# Altium schematic sheet 09 USB.SchDoc
size 420 x 297 mm
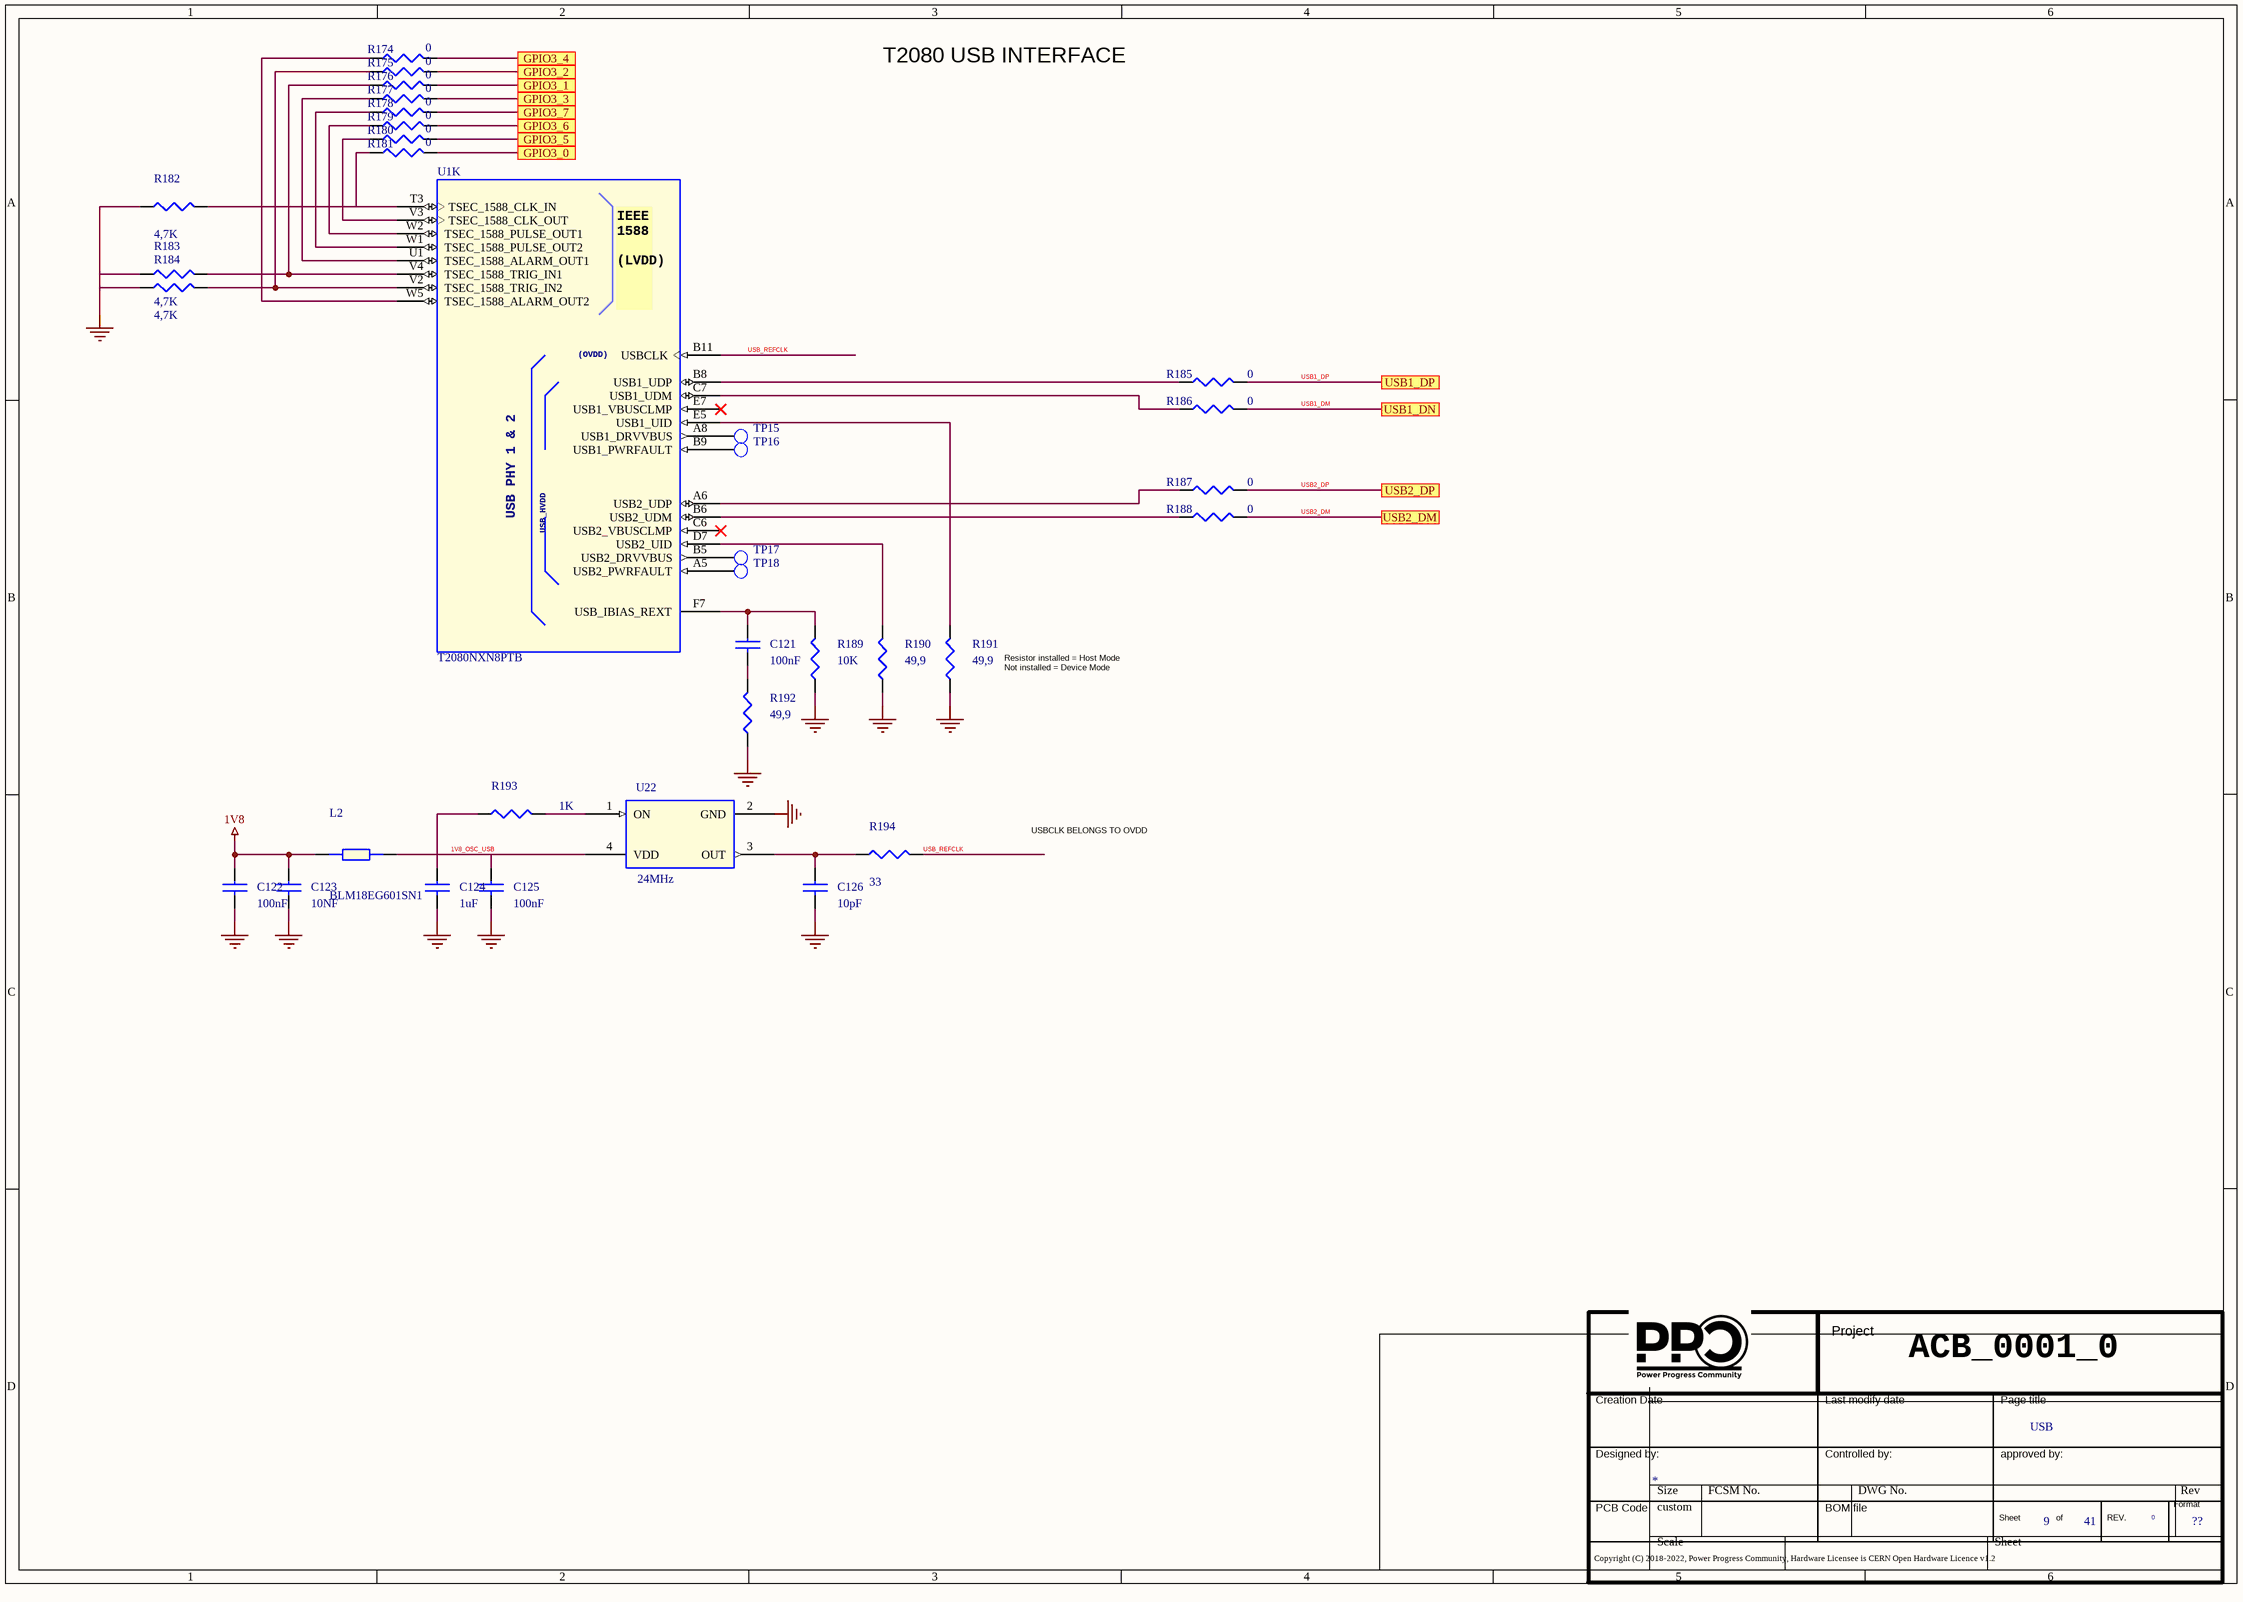
[diagram p0: 09 USB.SchDoc]

## Parts
*  Doc: USB  Page Count: 41  Page Number: 9  Page Size: ??  RevCode: 0  (hidden comment: Title_block_PPC)  (graphical)
C121  100nF  [SMD_0402]
C122  100nF  [SMD_0402]
C123  10NF  [SMD_0402]
C124  1uF  [SMD_0402]
C125  100nF  [SMD_0402]
C126  10pF  [SMD_0402]
L2  BLM18EG601SN1  [SMD_0603]
R174  0  [SMD_0402]
R175  0  [SMD_0402]
R176  0  [SMD_0402]
R177  0  [SMD_0402]
R178  0  [SMD_0402]
R179  0  [SMD_0402]
R180  0  [SMD_0402]
R181  0  [SMD_0402]
R182  4,7K  [SMD_0402]
R183  4,7K  [SMD_0402]
R184  4,7K  [SMD_0402]
R185  0  [SMD_0402]
R186  0  [SMD_0402]
R187  0  [SMD_0402]
R188  0  [SMD_0402]
R189  10K  [SMD_0402]
R190  49,9  [SMD_0402]
R191  49,9  [SMD_0402]
R192  49,9  [SMD_0402]
R193  1K  [SMD_0402]
R194  33  [SMD_0402]
TP15  TEST POINT  [PCB]  (value not drawn)
TP16  TEST POINT  [PCB]  (value not drawn)
TP17  TEST POINT  [PCB]  (value not drawn)
TP18  TEST POINT  [PCB]  (value not drawn)
U1  T2080NXN8PTB  [bga]  (part K of 14)
U22  24MHz  [4 PIN SMT]

## Ports
GPIO3_0, GPIO3_1, GPIO3_2, GPIO3_3, GPIO3_4, GPIO3_5, GPIO3_6, GPIO3_7, USB1_DN, USB1_DP, USB2_DM, USB2_DP

## Nets
1V8: C122.1 C123.1 L2.1
GND: C122.2 C123.2 C124.2 C125.2 C126.2 R182.1 R183.1 R184.1 R189.1 R190.1 R191.1 R192.1 U22.2(GND)
1V8_OSC_USB: C124.1 C125.1 L2.2 R193.1 U22.4(VDD)
GPIO3_0: R181.2 ; port GPIO3_0
GPIO3_1: R176.2 ; port GPIO3_1
GPIO3_2: R175.2 ; port GPIO3_2
GPIO3_3: R177.2 ; port GPIO3_3
GPIO3_4: R174.2 ; port GPIO3_4
GPIO3_5: R180.2 ; port GPIO3_5
GPIO3_6: R179.2 ; port GPIO3_6
GPIO3_7: R178.2 ; port GPIO3_7
USB1_DM: R186.2 ; port USB1_DN
USB1_DP: R185.2 ; port USB1_DP
USB2_DM: R188.2 ; port USB2_DM
USB2_DP: R187.2 ; port USB2_DP
USB_REFCLK: R194.2 U1.B11(USBCLK)
NetC121_1: C121.1 R189.2 U1.F7(USB_IBIAS_REXT)
NetC121_2: C121.2 R192.2
NetC126_1: C126.1 R194.1 U22.3(OUT)
NetR174_1: R174.1 U1.W5(TSEC_1588_ALARM_OUT2)
NetR175_1: R175.1 R184.2 U1.V2(TSEC_1588_TRIG_IN2)
NetR176_1: R176.1 R183.2 U1.V4(TSEC_1588_TRIG_IN1)
NetR177_1: R177.1 U1.U1(TSEC_1588_ALARM_OUT1)
NetR178_1: R178.1 U1.W1(TSEC_1588_PULSE_OUT2)
NetR179_1: R179.1 U1.W2(TSEC_1588_PULSE_OUT1)
NetR180_1: R180.1 U1.V3(TSEC_1588_CLK_OUT)
NetR181_1: R181.1 R182.2 U1.T3(TSEC_1588_CLK_IN)
NetR185_1: R185.1 U1.B8(USB1_UDP)
NetR186_1: R186.1 U1.C7(USB1_UDM)
NetR187_1: R187.1 U1.A6(USB2_UDP)
NetR188_1: R188.1 U1.B6(USB2_UDM)
NetR190_2: R190.2 U1.D7(USB2_UID)
NetR191_2: R191.2 U1.E5(USB1_UID)
NetR193_2: R193.2 U22.1(ON)
NetTP15_1: TP15.1(TP) U1.A8(USB1_DRVVBUS)
NetTP16_1: TP16.1(TP) U1.B9(USB1_PWRFAULT)
NetTP17_1: TP17.1(TP) U1.B5(USB2_DRVVBUS)
NetTP18_1: TP18.1(TP) U1.A5(USB2_PWRFAULT)

Not connected (* = marked no-connect by the designer): U1 C6(USB2_VBUSCLMP)* E7(USB1_VBUSCLMP)*

## Notes on the sheet
- T2080 USB INTERFACE
- Resistor installed = Host Mode
  Not installed = Device Mode
- USBCLK BELONGS TO OVDD
- ACB_0001_0
- (in symbol T2080, part K) IEEE 1588 / (LVDD); (OVDD); USB PHY 1 & 2; USB_HVDD
- (in symbol Title_block_PPC) Project; Creation Date; Last modify date; Page title; Designed by:; Controlled by:; approved by:; Format; PCB Code; BOM file; Sheet; of; REV.; Copyright (C) 2018-2022, Power Progress Community, Hardware Licensee is CERN Open Hardware Licence v1.2

## Library data of the parts
* = Title_block_PPC: Title: T2080PCIe; Author: MICETEK; Page Create Date: March  8, 1995; Page Title: ?; Page Modify Date: *
C121 = CAP NP_Dup3: COND.CER. 100NF 50V 0402 X7R SMD; Part Number: PASSIVE_24; Manufacturer 1: TDK; Manufacturer Part Number 1: CGA2B3X7R1H104M050BD; RSM: RC0402; Part Type: Capacitors\Ceramic\SMD\0402; PCB Footprint: SMD_0402
C122 C125 = CAP NP_Dup3: COND.CER. 100NF 50V 0402 X7R SMD; Manufacturer Part Number 1: CGA2B3X7R1H104M050BD; Manufacturer 1: TDK; Part Number: PASSIVE_24; RSM: RC0402; PCB Footprint: SMD_0402; Part Type: Capacitors\Ceramic\SMD\0402
C123 = CAP NP_Dup3: COND.CER. 10NF 16V 0402 X7R SMD; Part Number: PASSIVE_28; Manufacturer 1: AVX; Manufacturer Part Number 1: 0402YC103KAT2A; RSM: RC0402; Part Type: Capacitors\Ceramic\SMD\0402; PCB Footprint: SMD_0402
C124 = CAP NP_Dup3: CAP CER 1UF 25V X6S 0402; Part Number: PASSIVE_1446; Manufacturer 1: Murata; Manufacturer Part Number 1: GRM155C81E105KE11D; RSM: RC0402; Part Type: Capacitors\Ceramic\SMD\0402; PCB Footprint: SMD_0402
C126 = CAP NP_Dup3: COND.CER.10PF 50V 0402 NPO/COG SMD; Manufacturer Part Number 1: GRM1555C1H100JZ01D; Manufacturer 1: Murata; Part Number: PASSIVE_32; RSM: RC0402; Part Type: Capacitors\Ceramic\SMD\0402; PCB Footprint: SMD_0402
L2 = FERRITE_BEAD: FERRITE BEAD 600ohm 500mA 0603 SMD; Manufacturer Part Number 1: BLM18EG601SN1 SMD; Manufacturer 1: Murata; Part Number: PASSIVE_377; RSM: RC0603; Part Type: Ferrite Beads\SMD\0603; PCB Footprint: SMD_0603
R174-R181 R185-R188 = R_Dup6: RESIS.CHIP 0R 5% 0402 SMD; Part Number: PASSIVE_805; Manufacturer 1: ROYAL OHM; RSM: RC0402; Part Type: Resistors\Fixed\SMD\0402\5%; Manufacturer Part Number 1: RESIS.CHIP 0R 5% 0402 SMD; PCB Footprint: SMD_0402
  R174-R181: Distributor 1: CAMEL ELETTRONICA SRL  #
R182-R184 = R_Dup6: RESIS.CHIP 4,7K 5% 0402 SMD; Manufacturer 1: ROYAL OHM; Part Number: PASSIVE_861; RSM: RC0402; PCB Footprint: SMD_0402; Manufacturer Part Number 1: RESIS.CHIP 4,7K 5% 0402 SMD; Part Type: Resistors\Fixed\SMD\0402\5%
R189 = R_Dup6: RESIS.CHIP 10K 1% 0402 SMD; Manufacturer 1: ROYAL OHM; Part Number: PASSIVE_584; RSM: RC0402; Manufacturer Part Number 1: RESIS.CHIP 10K 1% 0402 SMD; Part Type: Resistors\Fixed\SMD\0402\1%; PCB Footprint: SMD_0402
R190-R192 = R_Dup6: RESIS.CHIP 49,9R 1% 0402 SMD; Manufacturer Part Number 1: NCR04F49R9TRF; Manufacturer 1: NIC; Part Number: PASSIVE_738; RSM: RC0402; Part Type: Resistors\Fixed\SMD\0402\1%; PCB Footprint: SMD_0402
R193 = R_Dup6: RESIS.CHIP 1K 1% 0402 SMD; Part Number: PASSIVE_628; Manufacturer 1: ROYAL OHM; RSM: RC0402; Part Type: Resistors\Fixed\SMD\0402\1%; Manufacturer Part Number 1: RESIS.CHIP 1K 1% 0402 SMD; PCB Footprint: SMD_0402
R194 = R_Dup6: RESIS.CHIP 33R 5% 0402 SMD; Part Number: PASSIVE_853; Manufacturer 1: ROYAL OHM; RSM: RC0402; Part Type: Resistors\Fixed\SMD\0402\5%; Manufacturer Part Number 1: RESIS.CHIP 33R 5% 0402 SMD; PCB Footprint: SMD_0402
TP15-TP18 = T POINT R: TEST POINT SU PCB; Part Number: CONNECTORS_542; RSM: AE-TESTPOINT; PCB Footprint: PCB; Part Type: Tpoint
U1 = T2080: QRIQ MPU 1.87GT/s DDR3/3L 4x10GE; Manufacturer 1: NXP; Part Number: MICROPROCESSOR_65; PCB Footprint: BGA896; Vendor: Freescale; RSM: PBGA896-0_8MM-26X25; Distributor 1: MOUSER(841-T2080NXN8PTB); Manufacturer Part Number 1: T2080NXN8PTB; Part Type: 32 BIT; TYPE: IC; MPN: T2080
U22 = OSCILLATOR: OSCILLATOR 24.000MHZ 1.8-3.3V 50ppm SMD; Part Number: MISC_87; Manufacturer 1: ABRACOM; Manufacturer Part Number 1: ASFLMB-24.000MHZ-LC-T; PCB Footprint: SMD_5.0x3.2; RSM: XC-ABM3B; Part Type: Oscillator; Distributor 1: DIGIKEY(535-11768-1-ND)